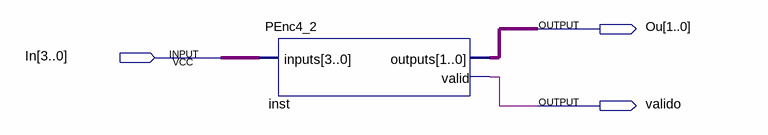
[diagram p0: schematic sheet]
// Quartus schematic PEnc4_2Demo.bdf as structural Verilog: 1 symbols, 3 pins
module PEnc4_2Demo (
  input  [3:0] In,
  output [1:0] Ou,
  output valido
);

  PEnc4_2 inst (.inputs(In), .outputs(Ou), .valid(valido));
endmodule
